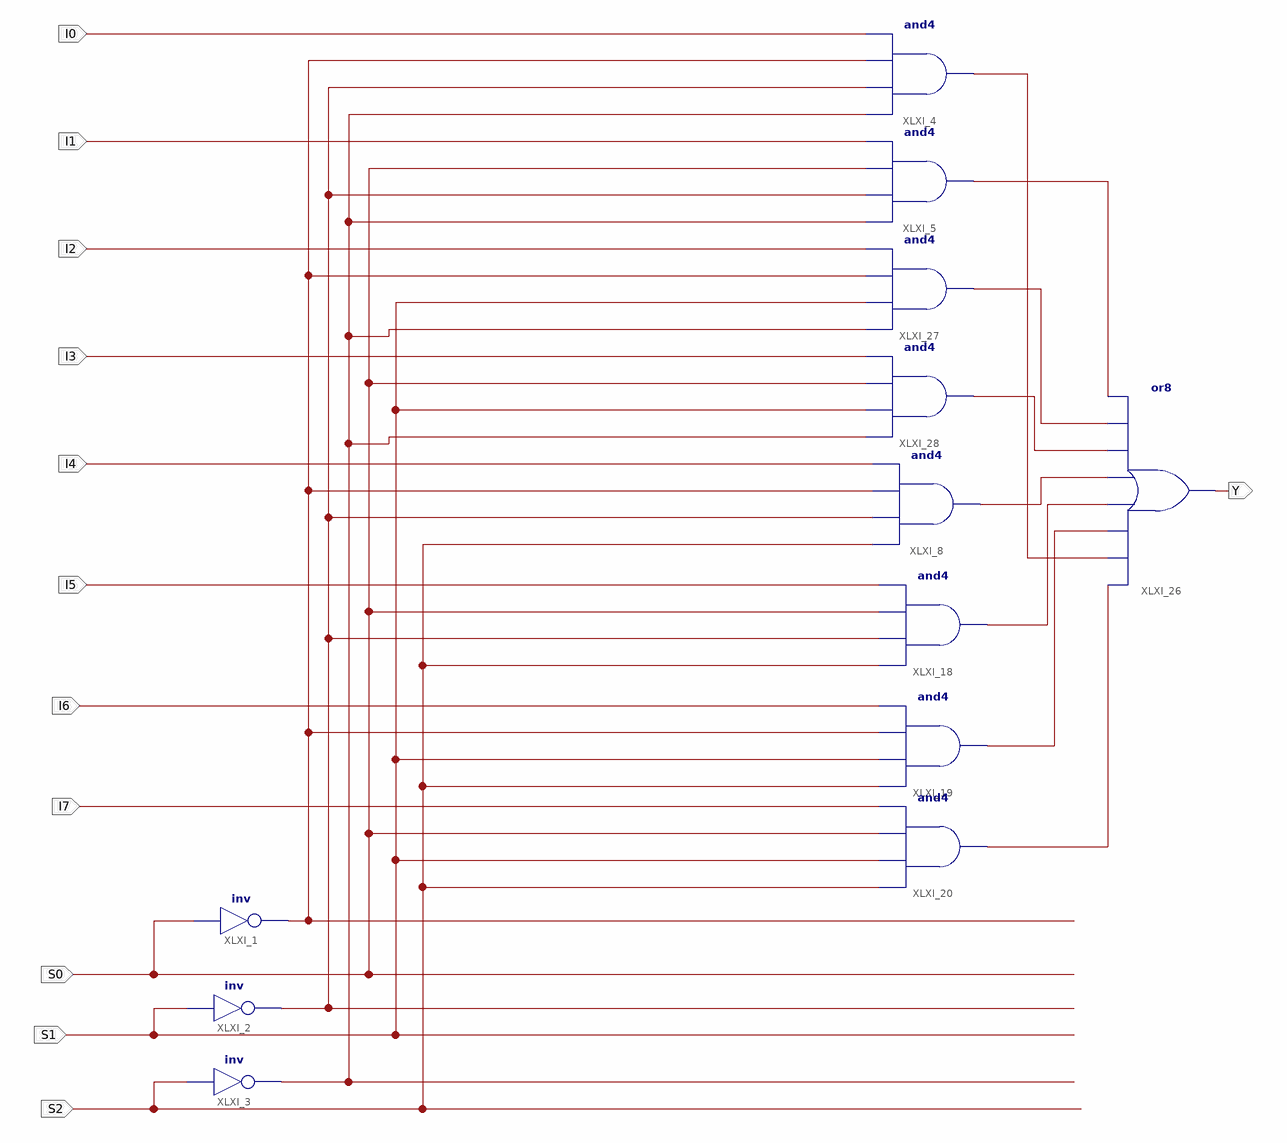
[diagram p0: schematic sheet 1]
// Xilinx ISE schematic mux_8_1.sch (artix7) as structural Verilog: 12 symbols, 12 ports
module mux_8_1 (
  input  I0,
  input  I1,
  input  I2,
  input  I3,
  input  I4,
  input  I6,
  input  I5,
  input  I7,
  input  S1,
  input  S2,
  input  S0,
  output Y
);

  wire XLXN_106, XLXN_107, XLXN_108, XLXN_123, XLXN_124, XLXN_125, XLXN_126, XLXN_127, XLXN_128, XLXN_129,
       XLXN_130;

  and XLXI_4 (XLXN_130, XLXN_108, XLXN_107, XLXN_106, I0);
  and XLXI_5 (XLXN_124, XLXN_108, XLXN_107, S0, I1);
  and XLXI_8 (XLXN_127, S2, XLXN_107, XLXN_106, I4);
  and XLXI_18 (XLXN_128, S2, XLXN_107, S0, I5);
  and XLXI_19 (XLXN_129, S2, S1, XLXN_106, I6);
  and XLXI_20 (XLXN_123, S2, S1, S0, I7);
  not XLXI_1 (XLXN_106, S0);
  not XLXI_3 (XLXN_108, S2);
  not XLXI_2 (XLXN_107, S1);
  or XLXI_26 (Y, XLXN_123, XLXN_130, XLXN_129, XLXN_128, XLXN_127, XLXN_126, XLXN_125, XLXN_124);
  and XLXI_27 (XLXN_125, XLXN_108, S1, XLXN_106, I2);
  and XLXI_28 (XLXN_126, XLXN_108, S1, S0, I3);
endmodule
